# EAGLE design Servo Ver 1.2 (EAGLE 6.0)
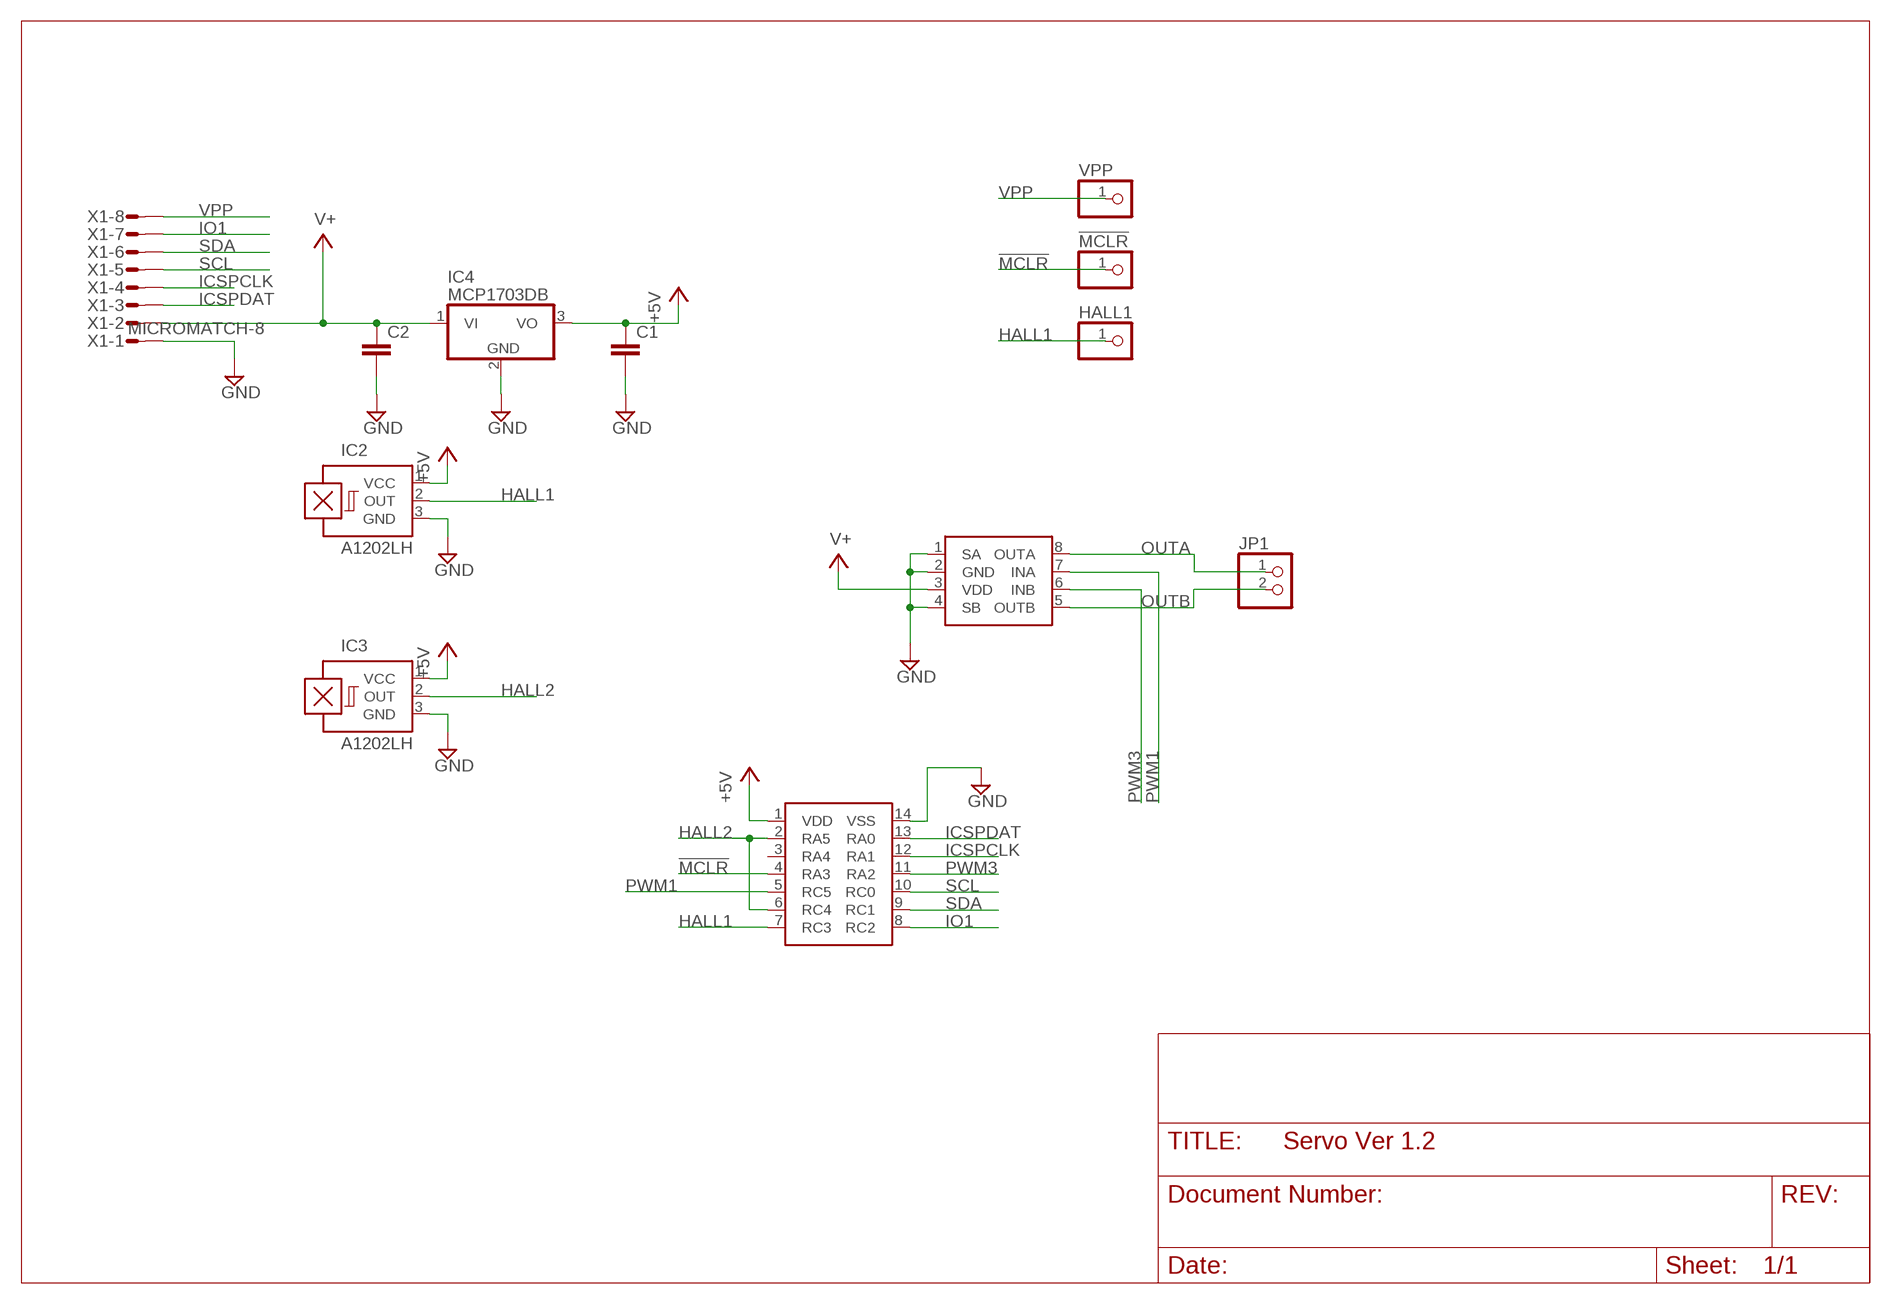
[diagram p0: schematic, sheet 1]

## Parts
!MCLR  PINHD-1X1  [1X01]
C1  C-EUC1206  [C1206]
C2  C-EUC1206  [C1206]
HALL1  PINHD-1X1  [1X01]
IC2  A1202LH  [SOT23-W]
IC3  A1202LH  [SOT23-W]
IC4  MCP1703DB  [SOT223]
JP1  PINHD-1X2  [1X02]
U$1  PIC16F1503SOIC  [SO-14]
U$2  SI9986SO8  [SO-08]
VPP  PINHD-1X1  [1X01]
X1  MICROMATCH-8  [MICROMATCH-8]

## Nets
!MCLR: !MCLR.1 U$1.4(RA3)
+5V: C1.1 IC2.1(VCC) IC3.1(VCC) IC4.3(VO) U$1.1(VDD)
GND: C1.2 C2.2 IC2.3(GND) IC3.3(GND) IC4.2(GND) U$1.14(VSS) U$2.1(SA) U$2.2(GND) U$2.4(SB) X1.1
HALL1: HALL1.1 IC2.2(OUT) U$1.7(RC3)
HALL2: IC3.2(OUT) U$1.2(RA5) U$1.6(RC4)
ICSPCLK: U$1.12(RA1) X1.4
ICSPDAT: U$1.13(RA0) X1.3
IO1: U$1.8(RC2) X1.7
OUTA: JP1.1 U$2.8(OUTA)
OUTB: JP1.2 U$2.5(OUTB)
PWM1: U$1.5(RC5) U$2.7(INA)
PWM3: U$1.11(RA2) U$2.6(INB)
SCL: U$1.10(RC0) X1.5
SDA: U$1.9(RC1) X1.6
V+: C2.1 IC4.1(VI) U$2.3(VDD) X1.2
VPP: VPP.1 X1.8
Unconnected: U$1.3(RA4)

## Library data of the parts
!MCLR HALL1 VPP = pinhead:PINHD-1X1: PIN HEADER
C1 C2 = rcl:C-EU: CAPACITOR, European symbol
IC2 IC3 = allegro:A12*?: Hall-effect bipolar switch Source: http://www.allegromicro.com/en/Products/Part_Numbers/1202/1202.pdf; OC_FARNELL: unknown; OC_NEWARK: unknown
IC4 = linear:MCP1703: 250 mA, 16V, Low Quiescent Current LDO Regulator Source: http://ww1.microchip.com/downloads/en/DeviceDoc/22049b.pdf
JP1 = pinhead:PINHD-1X2: PIN HEADER
U$1 = PIC16F1503:PIC16F1503
U$2 = si9986:SI9986
X1 = con-amp-micromatch:MICROMATCH-8: MicroMaTch 8 7-215464-8 / 0-215464-8 Drawing Number C-215464 DDEController.pdf; MF: FARNELL; MPN: 7-215464-8; OC_FARNELL: 3784642; OC_NEWARK: 26H0301

## Board
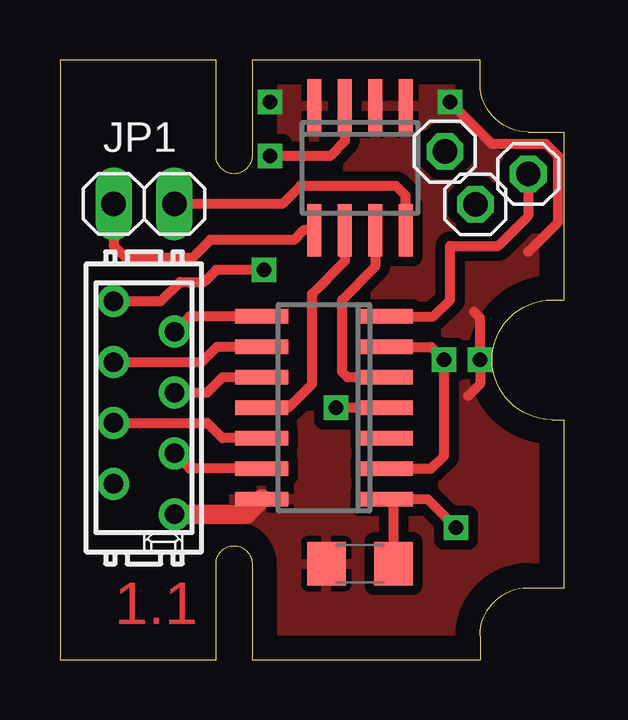
[diagram p1: board, top side]
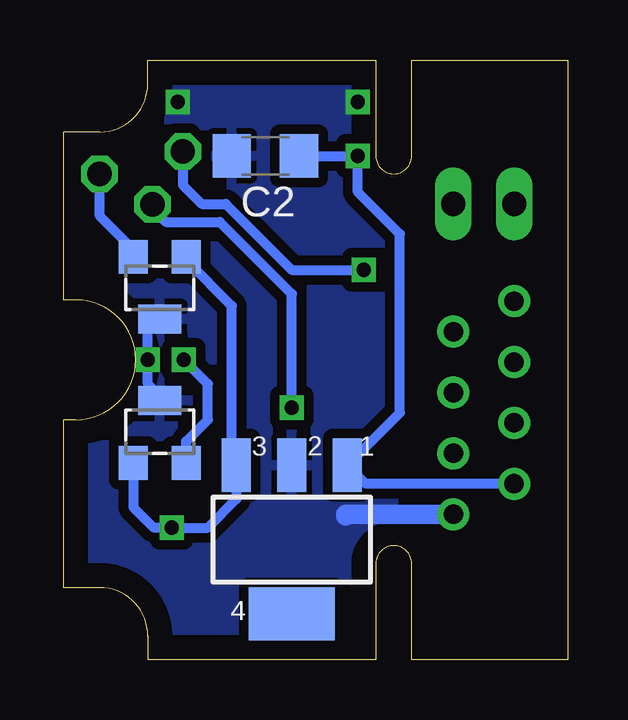
[diagram p2: board, bottom side, seen from below]

Size 21 x 25 mm. Coordinates in mm from the lower left corner, seen from the top.
Outline: 8,0 17.5,0 17.5,1 arc-90 19.5,3 21,3 21,10 20.5,10 arc-180 20.5,15 21,15 21,22 19.5,22 arc-90 17.5,24 17.5,25 8,25 8,21 arc-180 6.5,21 6.5,25 0,25 0,0 6.5,0 6.5,4 arc-180 8,4 8,0
Copper layers (1*16): Top 0.035mm / dielectric 1.5mm / Bottom 0.035mm
Design rules: minimum track width 8mil, minimum drill 0.6mm, track to track 8mil, track to pad 8mil, pad to pad 8mil, via to via 8mil, smd to smd 8mil, copper to edge 40mil, drill to drill 10mil, minimum pad ring 10mil, minimum via ring 8mil, stop-mask expansion 0mil, vias tented up to drill 0mil, thermal gap 10mil

### Footprints (pad centres in the part's own frame; a part is rotated, then mirrored left to right if it is on the bottom)
1X01 = drill 1.016 octagon: 1 0,0
C1206 = smd 1.6 x 1.8: 1 -1.4,0; 2 1.4,0
SOT23-W = smd 1.2 x 1.4: 1 -1.1,-1.3; 2 1.1,-1.3 | smd 1.8 x 1.2: 3 0,1.3
SOT223 = smd 1.219 x 2.235: 1 -2.311,-3.099; 2 0,-3.099; 3 2.311,-3.099 | smd 3.6 x 2.2: 4 0,3.099
1X02 = drill 1.016 long: 1 -1.27,0; 2 1.27,0
SO-14 = smd 0.6 x 2.2: 1 -3.81,-2.6; 2 -2.54,-2.6; 3 -1.27,-2.6; 4 0,-2.6; 5 1.27,-2.6; 6 2.54,-2.6; 7 3.81,-2.6; 8 3.81,2.6; 9 2.54,2.6; 10 1.27,2.6; 11 0,2.6; 12 -1.27,2.6; 13 -2.54,2.6; 14 -3.81,2.6
SO-08 = smd 0.6 x 2.2: 1 -1.905,-2.6; 2 -0.635,-2.6; 3 0.635,-2.6; 4 1.905,-2.6; 5 1.905,2.6; 6 0.635,2.6; 7 -0.635,2.6; 8 -1.905,2.6
MICROMATCH-8 = drill 0.813: 1 4.445,1.27; 2 3.175,-1.27; 3 1.905,1.27; 4 0.635,-1.27; 5 -0.635,1.27; 6 -1.905,-1.27; 7 -3.175,1.27; 8 -4.445,-1.27

### Placement (x,y rotation side)
!MCLR  17.31,18.98 0 top
C1  12.5,4 180 top
C2  12.6,21 180 bottom
HALL1  19.51,20.25 0 top
IC2  17,15.5 180 bottom
IC3  17,9.5 0 bottom
IC4  11.5,5 180 bottom
JP1  3.5,19 180 top
U$1  11,10.5 90 top
U$2  12.5,20.5 180 top
VPP  16.04,21.18 0 top
X1  3.5,10.5 270 top

### Tracks (layer width: path | path; a pad name or v marks a point on that pad's centre or on a via)
!MCLR  (via drill 0.6)
  Top 0.406: U$1.4 v11.5,10.5
  Bottom 0.406: v11.5,10.5 11.5,15.25 14.5,18.25 16.75,18.25 17.31,18.81 !MCLR.1
+5V  (via drill 0.6)
  Top 0.406: v16.5,5.5 15.31,6.69 U$1.1 13.9,6.39 13.9,4.1 14,4 C1.1
  Bottom 0.406: IC2.1 15.9,16.65 14,14.75 14,8.1 IC4.3 13.81,6.69 15,5.5 v16.5,5.5 17.25,5.5 18.1,6.35 IC3.1
GND  (via drill 0.6)
  Top 0.406: 17.25,14.5 17.5,14.25 v17.5,12.5 17.5,11.5 17,11 | 19.5,17 20.75,18.25 20.75,21 20.25,21.5 18,21.5 v16.25,23.25
  Top 0.813: U$1.14 7.77,6.05 X1.1
  Bottom 0.406: IC3.3 17,11 17.5,11.5 v17.5,12.5 17.5,13.7 IC2.3
  Bottom 0.813: X1.1 9.25,6.05 9.25,6
  other vias: 8.75,23.25
  pour Bottom (isolate 0.406): 7.25,25 21,25 21,0 7.25,0
  pour Top (isolate 0.406): 7.25,25 21,25 21,0 7.25,0
HALL1
  Top 0.406: U$1.7 15.56,14.31 16.25,15 16.25,17.25 18.25,17.25 19.5,18.5 HALL1.1
  Bottom 0.406: IC2.2 18.1,17.1 19.5,18.5 HALL1.1
HALL2  (via drill 0.6)
  Top 0.406: U$1.2 15.46,7.96 16,8.5 v16,12.5 15.46,13.04 U$1.6
  Bottom 0.406: IC3.2 15.9,9.1 15,10 15,11.5 v16,12.5
ICSPCLK
  Top 0.406: X1.4 6.14,9.87 6.77,9.23 U$1.12
ICSPDAT
  Top 0.406: U$1.13 5.41,7.96 X1.3
IO1
  Top 0.406: U$1.8 5.41,14.31 X1.7
OUTA
  Top 0.406: U$2.8 14.41,19.34 14,19.75 10,19.75 9.25,19 JP1.1 4.75,19
OUTB
  Top 0.406: JP1.2 2.23,17.27 2.75,16.75 5.5,16.75 6.25,17.5 9.75,17.5 10.15,17.9 U$2.5
PWM1
  Top 0.406: U$1.5 11.98,11.77 11.75,12 11.75,15 13.14,16.39 U$2.7
PWM3
  Top 0.406: U$1.11 9.5,10.5 10.5,11.5 10.5,15.25 11.86,16.61 U$2.6
SCL
  Top 0.406: X1.5 6.14,11.13 6.77,11.77 U$1.10
SDA
  Top 0.406: U$1.9 6.54,13.04 5.91,12.4 X1.6
V+  (via drill 0.6)
  Top 0.406: U$2.3 11.86,21.61 11.25,21 v8.75,21
  Bottom 0.406: X1.2 8.41,7.33 IC4.1 7,10.29 7,17.75 8.75,19.5 v8.75,21 C2.1
VPP  (via drill 0.6)
  Top 0.406: v8.5,16.25 6.5,16.25 6,15.75 5,15.75 4.2,14.95 X1.8
  Bottom 0.406: v8.5,16.25 11.5,16.25 14.25,19 15.25,19 16.04,19.79 VPP.1

### Text on the board
Top: 1.1